# EAGLE design Tiles_Proto3_RevA (EAGLE 8.2.0)
CNAME: TIles Prototype 3; CREVISION: A; DESIGNER: Simone Mora
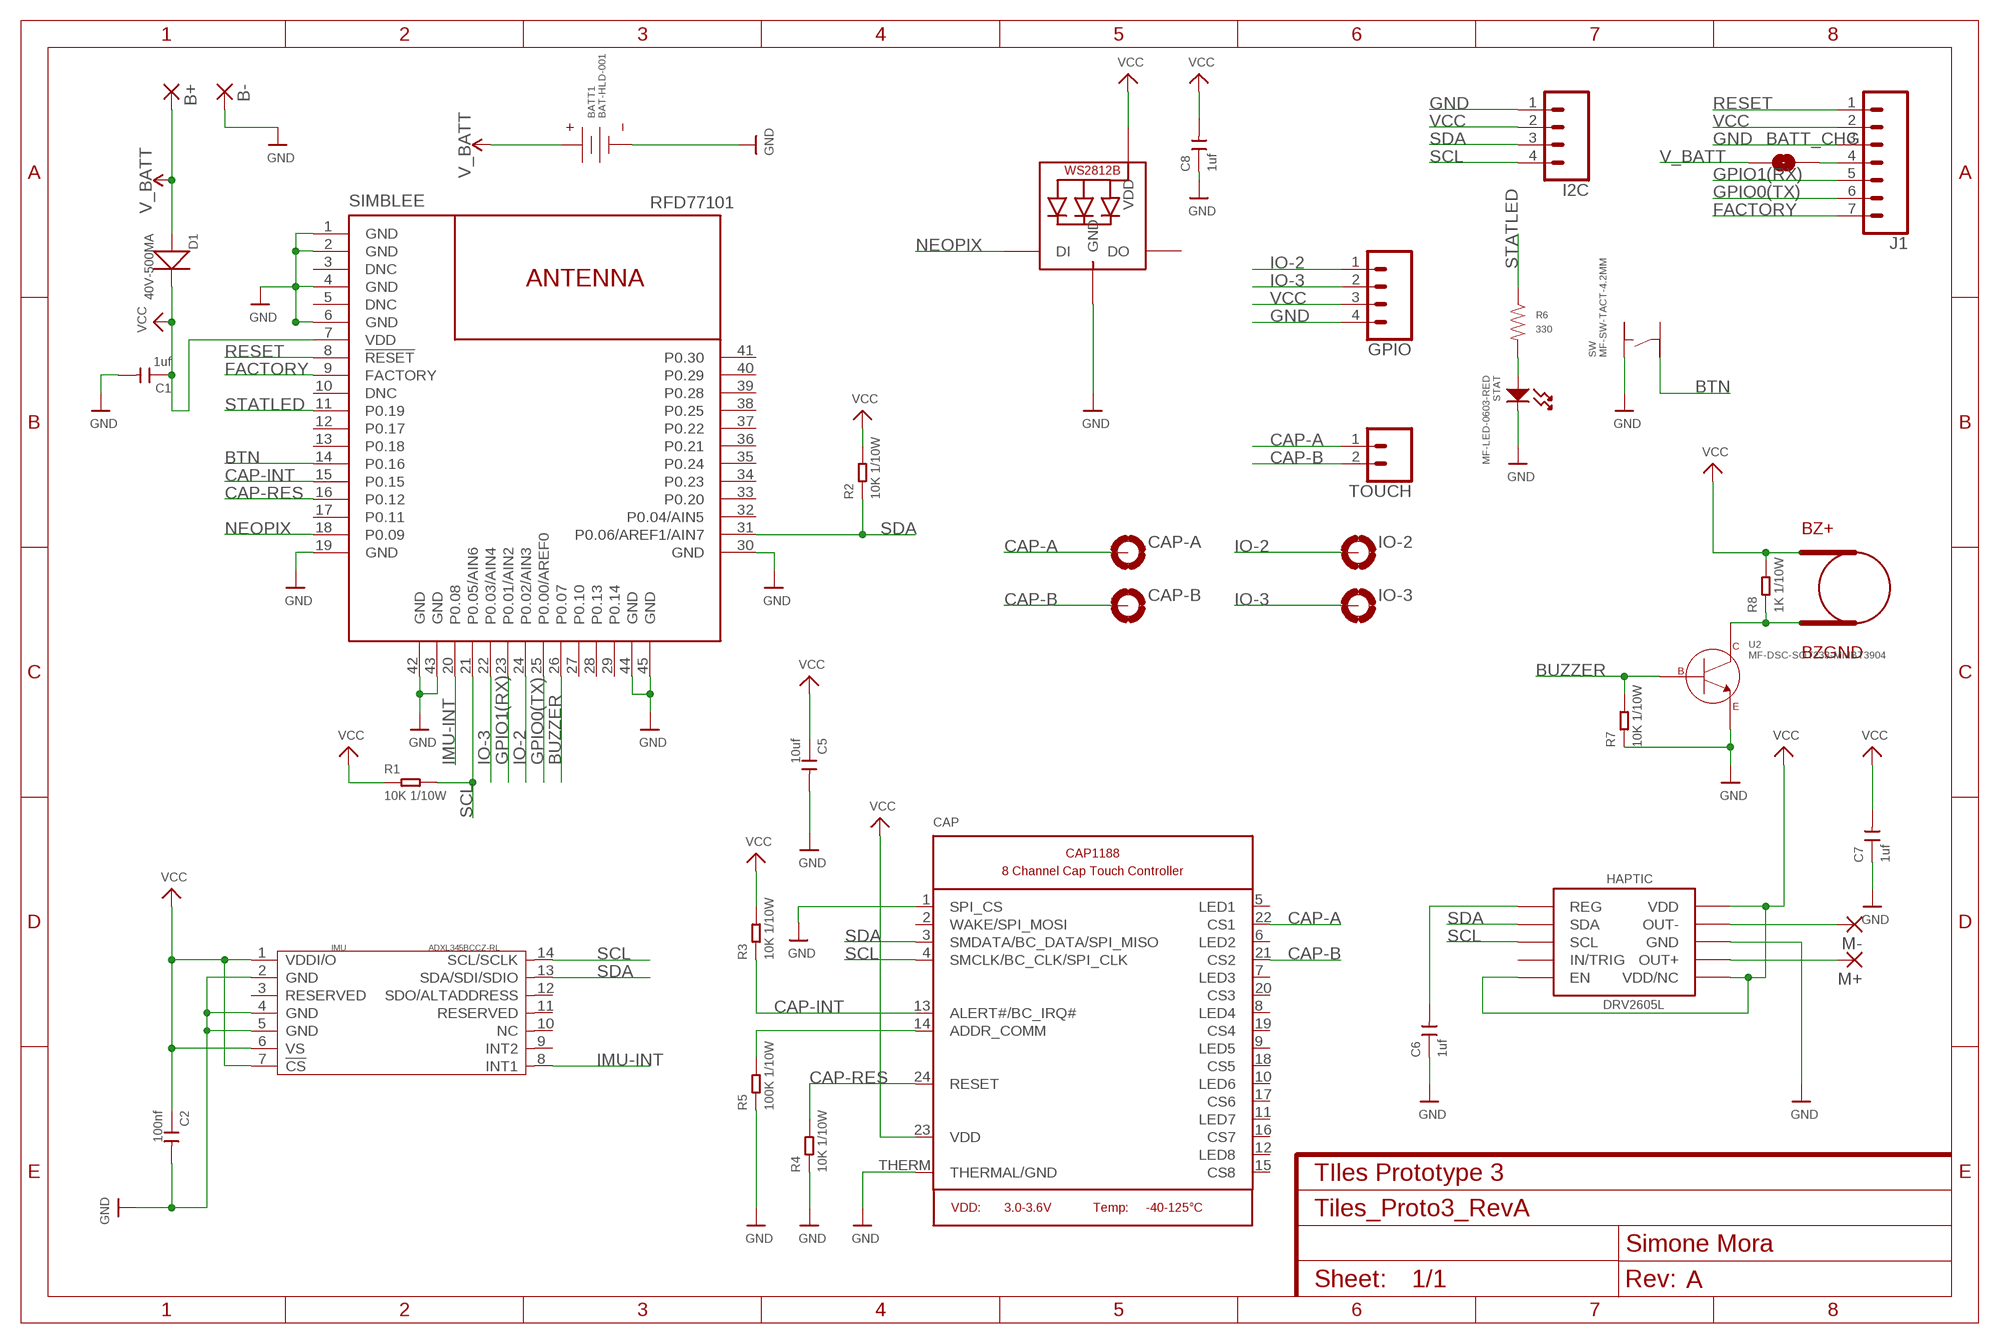
[diagram p0: schematic, sheet 1]

## Parts
B+  1,6/0,8  [1,6/0,8]
B-  1,6/0,8  [1,6/0,8]
BATT1  BAT-HLD-001  BATTERY-SMALL_BAT-HLD-001  [BAT-HLD-001]
BATT_CHG  JUMPER-SMT_2_NO_NO-SILK  [SMT-JUMPER_2_NO_NO-SILK]
BUZZER  4MBUZ  [BUZPKG]
C1  1uf  CERAMIC-10UF-10V-10%-X5R(0603)  [C0603]
C2  100nf  CERAMIC-100NF-50V-10%-X7R(0603)  [C0603]
C5  10uf  CERAMIC-10UF-10V-10%-X5R(0603)  [C0603]
C6  1uf  CERAMIC-1UF-25V-10%-X7R(0603)  [C0603]
C7  1uf  CERAMIC-1UF-25V-10%-X7R(0603)  [C0603]
C8  1uf  CERAMIC-1UF-25V-10%-X7R(0603)  [C0603]
CAP  CAP1188  [QFN24_4MM_SMSC]
CAP-A  MOUNT-PAD-ROUND2.5  [2,5-PAD-SIM]
CAP-B  MOUNT-PAD-ROUND2.5  [2,5-PAD-SIM]
D1  40V-500MA  SMD-DIODE-SCHOTTKY-40V-500MA(SOD-123)  [SOD-123]
GPIO  CONN_041X04_NO_SILK  [1X04_NO_SILK]
HAPTIC  DRV2605L  [VSSOP-10]
I2C  CONN_04_SIM1X04_NO_SILK  [1X04_NO_SILK_LNG]
IMU  ADXL345BCCZ-RL  MOTION/POSITION-ADXL345BCCZ-RL(14P-5.0X3.0MM)  [LGA14-0.8-5.0X3.0MM]
IO-2  MOUNT-PAD-ROUND2.5  [2,5-PAD-SIM]
IO-3  MOUNT-PAD-ROUND2.5  [2,5-PAD-SIM]
J1  CONN_07_SIMSQPAD_BOTTOM  [1X07_SQUAREPADS_BOTTOM]
LED  WS2812B3535  [LED3535]
M+  1,6/0,8  [1,6/0,8]
M-  1,6/0,8  [1,6/0,8]
R1  10K 1/10W  SMD-RES-10K-5%-1/10W(0603)  [R0603]
R2  10K 1/10W  SMD-RES-10K-5%-1/10W(0603)  [R0603]
R3  10K 1/10W  SMD-RES-10K-5%-1/10W(0603)  [R0603]
R4  10K 1/10W  SMD-RES-10K-5%-1/10W(0603)  [R0603]
R5  100K 1/10W  SMD-RES-100K-5%-1/10W(0603)  [R0603]
R6  330  RESISTOR_0603  [R0603]
R7  10K 1/10W  SMD-RES-10K-5%-1/10W(0603)  [R0603]
R8  1K 1/10W  SMD-RES-10K-5%-1/10W(0603)  [R0603]
SIMBLEE  RFD77101  [RFD77101]
STAT  MF-LED-0603-RED  LED_SINGLE-0603-RED  [LED0603]
SW  MF-SW-TACT-4.2MM  TACT_4.2MM  [TACT4.2MM]
TOUCH  CONN_021X02_NO_SILK  [1X02_NO_SILK]
U2  MF-DSC-SOT233-MMBT3904  NPN_BJTMMBT3904_SOT-23-3  [SOT-23-3]

## Nets
BTN: SIMBLEE.14(P0.16) SW.P$3
BUZZER: R7.2 SIMBLEE.26(P0.07) U2.P$1(BASE)
CAP-A: CAP-A.B2,8(MOUNT) CAP.22(CS1) TOUCH.1
CAP-B: CAP-B.B2,8(MOUNT) CAP.21(CS2) TOUCH.2
CAP-INT: CAP.13(ALERT#/BC_IRQ#) R3.1 SIMBLEE.15(P0.15)
CAP-RES: CAP.24(RESET) R4.2 SIMBLEE.16(P0.12)
FACTORY: J1.7 SIMBLEE.9(FACTORY)
GND: B-.1(P) BATT1.NEG_0(NEG) C1.2 C2.2 C5.2 C6.1 C7.1 C8.1 CAP.1(SPI_CS) CAP.THERM(THERMAL/GND) GPIO.4 HAPTIC.P$8(GND) I2C.1 IMU.2(GND) IMU.4(GND) IMU.5(GND) J1.3 LED.4(GND) R4.1 R5.1 R7.1 SIMBLEE.1(GND) SIMBLEE.2(GND) SIMBLEE.4(GND) SIMBLEE.6(GND) SIMBLEE.19(GND) SIMBLEE.30(GND) SIMBLEE.42(GND) SIMBLEE.43(GND) SIMBLEE.44(GND) SIMBLEE.45(GND) STAT.CATHODE SW.P$1 U2.P$2(EMITTER)
GPIO0(TX): J1.6 SIMBLEE.25(P0.00/AREF0)
GPIO1(RX): J1.5 SIMBLEE.23(P0.01/AIN2)
IMU-INT: IMU.8(INT1) SIMBLEE.20(P0.08)
IO-2: GPIO.1 IO-2.B2,8(MOUNT) SIMBLEE.24(P0.02/AIN3)
IO-3: GPIO.2 IO-3.B2,8(MOUNT) SIMBLEE.22(P0.03/AIN4)
N$3: CAP.14(ADDR_COMM) R5.2
N$4: BUZZER.BZ-(BUZGND) R8.1 U2.P$3(COLLECTOR)
N$5: C6.2 HAPTIC.P$1(REG)
N$6: BATT_CHG.2 J1.4
N$7: HAPTIC.P$9(OUT-) M-.1(P)
N$8: HAPTIC.P$7(OUT+) M+.1(P)
N$9: R6.P$2 STAT.ANODE
NEOPIX: LED.1(DI) SIMBLEE.18(P0.09)
RESET: J1.1 SIMBLEE.8(!RESET!)
SCL: CAP.4(SMCLK/BC_CLK/SPI_CLK) HAPTIC.P$2(SCL) I2C.4 IMU.14(SCL/SCLK) R1.2 SIMBLEE.21(P0.05/AIN6)
SDA: CAP.3(SMDATA/BC_DATA/SPI_MISO) HAPTIC.P$3(SDA) I2C.3 IMU.13(SDA/SDI/SDIO) R2.1 SIMBLEE.31(P0.06/AREF1/AIN7)
STATLED: R6.P$1 SIMBLEE.11(P0.19)
V_BATT: B+.1(P) BATT1.POS_0(POS) BATT1.POS_1(POS) BATT_CHG.1 D1.+
VCC: BUZZER.BZ+(BUZSIG+) C1.1 C2.1 C5.1 C7.2 C8.2 CAP.23(VDD) D1.- GPIO.3 HAPTIC.P$5(EN) HAPTIC.P$6(VDD/NC) HAPTIC.P$10(VDD) I2C.2 IMU.1(VDDI/O) IMU.6(VS) IMU.7(!CS) J1.2 LED.2(VDD) R1.1 R2.2 R3.2 R8.2 SIMBLEE.7(VDD)
Unconnected: CAP.2(WAKE/SPI_MOSI) CAP.5(LED1) CAP.6(LED2) CAP.7(LED3) CAP.8(LED4) CAP.9(LED5) CAP.10(LED6) CAP.11(LED7) CAP.12(LED8) CAP.15(CS8) CAP.16(CS7) CAP.17(CS6) CAP.18(CS5) CAP.19(CS4) CAP.20(CS3) HAPTIC.P$4(IN/TRIG) IMU.3(RESERVED) IMU.9(INT2) IMU.10(NC) IMU.11(RESERVED) IMU.12(SDO/ALTADDRESS) LED.3(DO) SIMBLEE.3(DNC) SIMBLEE.5(DNC) SIMBLEE.10(DNC) SIMBLEE.12(P0.17) SIMBLEE.13(P0.18) SIMBLEE.17(P0.11) SIMBLEE.27(P0.10) SIMBLEE.28(P0.13) SIMBLEE.29(P0.14) SIMBLEE.32(P0.04/AIN5) SIMBLEE.33(P0.20) SIMBLEE.34(P0.23) SIMBLEE.35(P0.24) SIMBLEE.36(P0.21) SIMBLEE.37(P0.22) SIMBLEE.38(P0.25) SIMBLEE.39(P0.28) SIMBLEE.40(P0.29) SIMBLEE.41(P0.30) SW.P$2 SW.P$4

## Library data of the parts
B+ B- M+ M- = wirepad:1,6/0,8: THROUGH-HOLE PAD
BATT1 = tiles:BATTERY-SMALL: Library: MF_Connectors Description: Batterys and Battery Connectors.; HOUSEPART: NO; MPN: BAT-HLD-001; POPULATE: 1; URL: http://www.mouser.com/ds/2/238/bat-hld-001-220194.pdf
BATT_CHG = SparkFun-Jumpers:JUMPER-SMT_2_NO: Normally open jumper This jumper has two pads in close proximity to each other. Apply solder to close the connection. Round pads are easier to solder for beginners, but are a lot larger. SparkFun Product that uses the round pads: SparkFun EL Sequencer <https://www.sparkfun.com/products/12781>
BUZZER = tiles:4MBUZ
C1 = Seeed-OPL-Capacitor:CERAMIC-10UF-10V-10%-X5R(0603): 302010103; MPN: CC0603KRX5R6BB106; VALUE: 10uf
C2 = Seeed-OPL-Capacitor:CERAMIC-100NF-50V-10%-X7R(0603): 302010138; MPN: CC0603KRX7R9BB104
C5 = Seeed-OPL-Capacitor:CERAMIC-10UF-10V-10%-X5R(0603): 302010103; MPN: CC0603KRX5R6BB106
C6-C8 = Seeed-OPL-Capacitor:CERAMIC-1UF-25V-10%-X7R(0603): 302010139; MPN: CC0603KRX7R8BB105
CAP = cap1188-microbuilder:CAP1188: CAP1188 - Eight Channel Cap Touch Controller
CAP-A CAP-B IO-2 IO-3 = tiles:MOUNT-PAD-ROUND: MOUNTING PAD, round
D1 = Seeed-OPL-2017-01-Diode-james:SMD-DIODE-SCHOTTKY-40V-500MA(SOD-123): 304020012; MPN: B0540W
GPIO = SparkFun-Connectors:CONN_04: Multi connection point. Often used as Generic Header-pin footprint for 0.1 inch spaced/style header connections On any of the 0.1 inch spaced packages, you can populate with these: Break Away Headers - Straight <https://www.sparkfun.com/products/116> (PRT-00116) Break Away Male Headers - Right Angle <https://www.sparkfun.com/products/553> (PRT-00553) Female Headers <https://www.sparkfun.com/products/115> (PRT-00115) Break Away Headers - Machine Pin <https://www.sparkfun.com/products/117> (PRT-00117) Break Away Female Headers - Swiss Machine Pin <https://www.sparkfun.com/products/743> (PRT-00743) For SCREWTERMINALS and SPRING TERMINALS visit here: Screw Terimnals on SparkFun.com <https://www.sparkfun.com/search/results?term=Screw+Terminals> (5mm/3.5mm/2.54mm spacing) This device is also useful as a general connection point to wire up your design to another part of your project. Our various solder wires solder well into these plated through hole pads. Hook-Up Wire - Assortment (Stranded, 22 AWG) <https://www.sparkfun.com/products/11375> (PRT-11375) Hook-Up Wire - Assortment (Solid Core, 22 AWG) <https://www.sparkfun.com/products/11367> (PRT-11367) View the entire wire category on our website here <https://www.sparkfun.com/categories/141> Special notes: Molex polarized connector foot print use with SKU : PRT-08231 with associated crimp pins and housings. 1MM SMD Version SKU: PRT-10208; PROD_ID: CONN-09696
HAPTIC = SparkFun-IC-Special-Function:DRV2605L; PROD_ID: IC-13504
I2C = tiles:CONN_04_SIM: Multi connection point. Often used as Generic Header-pin footprint for 0.1 inch spaced/style header connections On any of the 0.1 inch spaced packages, you can populate with these: Break Away Headers - Straight <https://www.sparkfun.com/products/116> (PRT-00116) Break Away Male Headers - Right Angle <https://www.sparkfun.com/products/553> (PRT-00553) Female Headers <https://www.sparkfun.com/products/115> (PRT-00115) Break Away Headers - Machine Pin <https://www.sparkfun.com/products/117> (PRT-00117) Break Away Female Headers - Swiss Machine Pin <https://www.sparkfun.com/products/743> (PRT-00743) For SCREWTERMINALS and SPRING TERMINALS visit here: Screw Terimnals on SparkFun.com <https://www.sparkfun.com/search/results?term=Screw+Terminals> (5mm/3.5mm/2.54mm spacing) This device is also useful as a general connection point to wire up your design to another part of your project. Our various solder wires solder well into these plated through hole pads. Hook-Up Wire - Assortment (Stranded, 22 AWG) <https://www.sparkfun.com/products/11375> (PRT-11375) Hook-Up Wire - Assortment (Solid Core, 22 AWG) <https://www.sparkfun.com/products/11367> (PRT-11367) View the entire wire category on our website here <https://www.sparkfun.com/categories/141> Special notes: Molex polarized connector foot print use with SKU : PRT-08231 with associated crimp pins and housings. 1MM SMD Version SKU: PRT-10208; PROD_ID: CONN-09696
IMU = Seeed-OPL-sensor:MOTION/POSITION-ADXL345BCCZ-RL(14P-5.0X3.0MM): 314080008; MPN: ADXL345BCCZ-RL
J1 = tiles:CONN_07_SIM: Multi connection point. Often used as Generic Header-pin footprint for 0.1 inch spaced/style header connections On any of the 0.1 inch spaced packages, you can populate with these: Break Away Headers - Straight <https://www.sparkfun.com/products/116> (PRT-00116) Break Away Male Headers - Right Angle <https://www.sparkfun.com/products/553> (PRT-00553) Female Headers <https://www.sparkfun.com/products/115> (PRT-00115) Break Away Headers - Machine Pin <https://www.sparkfun.com/products/117> (PRT-00117) Break Away Female Headers - Swiss Machine Pin <https://www.sparkfun.com/products/743> (PRT-00743) For SCREWTERMINALS and SPRING TERMINALS visit here: Screw Terimnals on SparkFun.com <https://www.sparkfun.com/search/results?term=Screw+Terminals> (5mm/3.5mm/2.54mm spacing) This device is also useful as a general connection point to wire up your design to another part of your project. Our various solder wires solder well into these plated through hole pads. Hook-Up Wire - Assortment (Stranded, 22 AWG) <https://www.sparkfun.com/products/11375> (PRT-11375) Hook-Up Wire - Assortment (Solid Core, 22 AWG) <https://www.sparkfun.com/products/11367> (PRT-11367) View the entire wire category on our website here <https://www.sparkfun.com/categories/141> Special notes: Molex polarized connector foot print use with SKU : PRT-08231 with associated crimp pins and housings. 1MM SMD Version SKU: PRT-10208 NOTES ON THE VARIANTS LOCK and LOCK_LONGPADS... This footprint was designed to help hold the alignment of a through-hole component (i.e. 6-pin header) while soldering it into place. You may notice that each hole has been shifted either up or down by 0.005 of an inch from it's more standard position (which is a perfectly straight line). This slight alteration caused the pins (the squares in the middle) to touch the edges of the holes. Because they are alternating, it causes a "brace" to hold the component in place. 0.005 has proven to be the perfect amount of "off-center" position when using our standard breakaway headers. Although looks a little odd when you look at the bare footprint, once you have a header in there, the alteration is very hard to notice. Also,if you push a header all the way into place, it is covered up entirely on the bottom side.
LED = adafruit:WS2812B
R1-R4 R7 = Seeed-OPL-Resistor:SMD-RES-10K-5%-1/10W(0603): 301010293; MPN: RC0603JR-0710KL
R5 = Seeed-OPL-Resistor:SMD-RES-100K-5%-1/10W(0603): 301010089; MPN: RC0603JR-07100KL
R6 = MF_Passives:RESISTOR: Library: MF_Passives Description: Device for Resistors. Manufacture part number (MPN), Voltage, Tolerance, and Wattage Rating can be added via Attributes. Check https://factory.macrofab.com/parts for the house parts list.; POPULATE: 1
R8 = Seeed-OPL-Resistor:SMD-RES-10K-5%-1/10W(0603): 301010293; VALUE: 10K 1/10W
SIMBLEE = SparkFun-RF:RFD77101: Simblee  BLE Module RFD77101 © 2015 RF Digital Corporation Datasheet <https://cdn.sparkfun.com/datasheets/IoT/Simblee%20RFD77101%20Datasheet%20v1.0.pdf> PATENTS PENDING 04.01.2015 Bluetooth Smart radio transceiver, ARM Cortex M0 microcontroller. 128kB Flash, 24kB RAM, no EEPROM Arduino-compatible. SparkFun Products: Simblee BLE Module - RFD77101 <https://www.sparkfun.com/products/13808> SparkFun Simblee BLE Breakout - RFD77101 <https://www.sparkfun.com/products/13632>; PROD_ID: COMP-13237; SF_ID: WRL-13808
STAT = MF_LEDs:LED_SINGLE: Library: MF_LEDs Description: Device for Single LED Packages. Manufacture part number (MFG#) can be added via Attributes.; HOUSEPART: YES; MPN: MF-LED-0603-RED; POPULATE: 1; URL: https://factory.macrofab.com/part/MF-LED-0603-RED
SW = MF_Switches:TACT: Library: MF_Switches Description: Device for Tact Switches. Manufacture part number (MFG#) can be added via Attributes.; HOUSEPART: YES; MPN: MF-SW-TACT-4.2MM; POPULATE: 1; URL: https://factory.macrofab.com/part/MF-SW-TACT-4.2MM
TOUCH = SparkFun-Connectors:CONN_02: Multi connection point. Often used as Generic Header-pin footprint for 0.1 inch spaced/style header connections On any of the 0.1 inch spaced packages, you can populate with these: Break Away Headers - Straight <https://www.sparkfun.com/products/116> (PRT-00116) Break Away Male Headers - Right Angle <https://www.sparkfun.com/products/553> (PRT-00553) Female Headers <https://www.sparkfun.com/products/115> (PRT-00115) Break Away Headers - Machine Pin <https://www.sparkfun.com/products/117> (PRT-00117) Break Away Female Headers - Swiss Machine Pin <https://www.sparkfun.com/products/743> (PRT-00743) For SCREWTERMINALS and SPRING TERMINALS visit here: Screw Terimnals on SparkFun.com <https://www.sparkfun.com/search/results?term=Screw+Terminals> (5mm/3.5mm/2.54mm spacing) This device is also useful as a general connection point to wire up your design to another part of your project. Our various solder wires solder well into these plated through hole pads. Hook-Up Wire - Assortment (Stranded, 22 AWG) <https://www.sparkfun.com/products/11375> (PRT-11375) Hook-Up Wire - Assortment (Solid Core, 22 AWG) <https://www.sparkfun.com/products/11367> (PRT-11367) View the entire wire category on our website here <https://www.sparkfun.com/categories/141> Special notes: Molex polarized connector foot print use with: PRT-08233 with associated crimp pins and housings. 2.54_SCREWTERM for use with PRT-10571. 3.5mm Screw Terminal footprints for PRT-08084 5mm Screw Terminal footprints for use with PRT-08432
U2 = MF_Discrete_Semiconductor:NPN_BJT: Library: MF_Discrete_Semiconductor Description: Device for Single NPN BJT Transistors. Manufacture part number (MFG#) can be added via Attributes.; HOUSEPART: YES; MPN: MF-DSC-SOT233-MMBT3904; POPULATE: 1; URL: https://factory.macrofab.com/part/MF-DSC-SOT233-MMBT3904

## Board
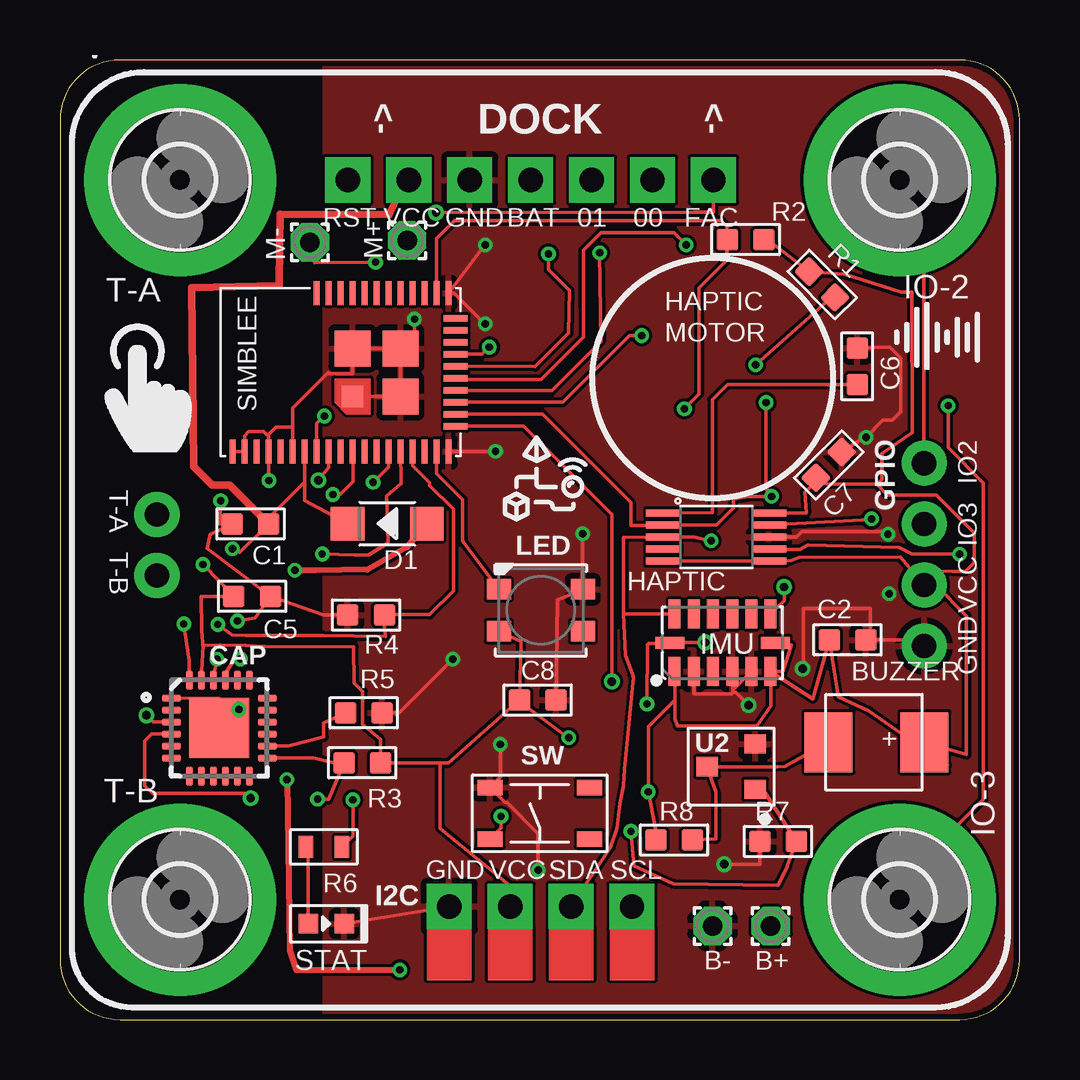
[diagram p1: board, top side]
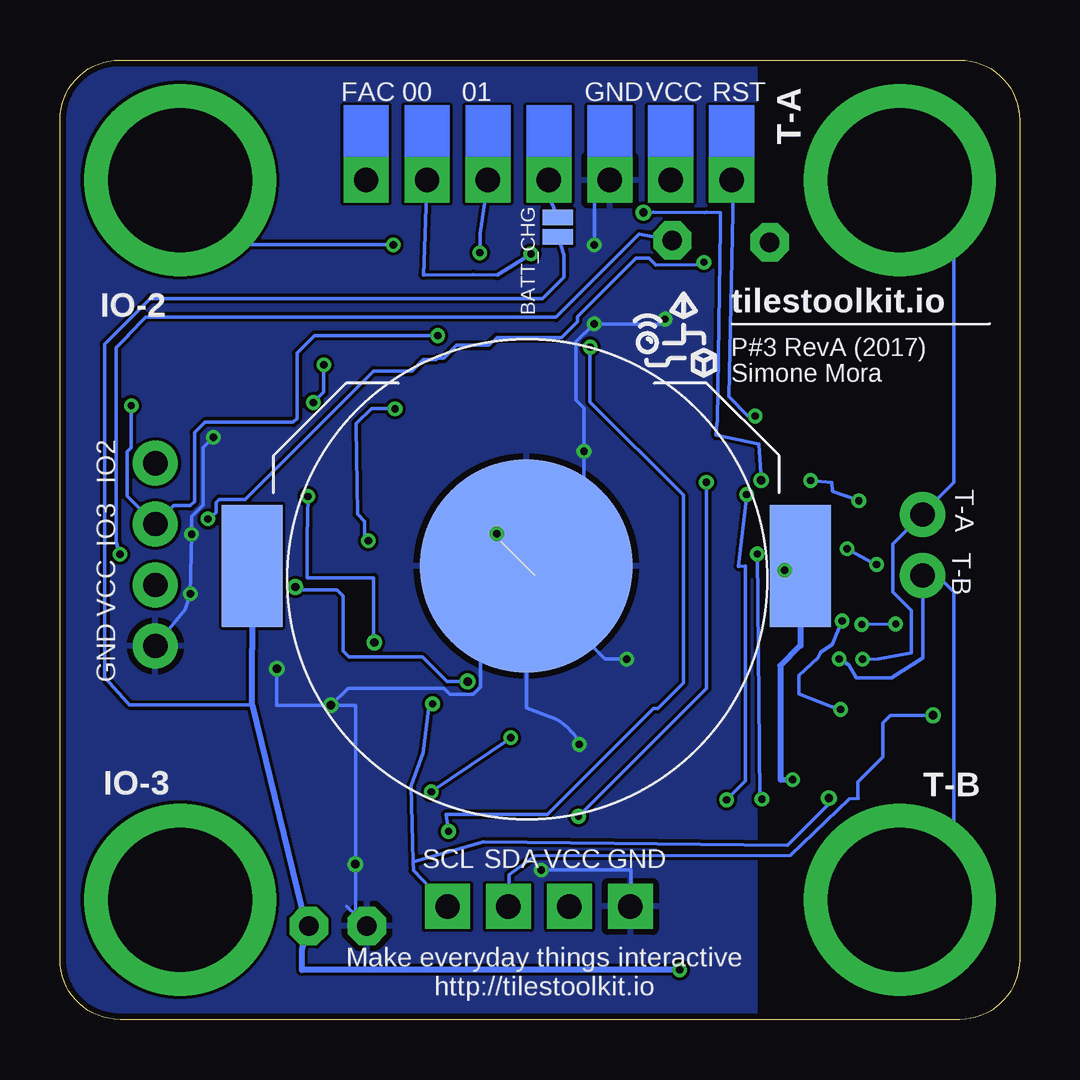
[diagram p2: board, bottom side, seen from below]

Size 40 x 40 mm. Coordinates in mm from the lower left corner, seen from the top.
Outline: 2.5,0 37.5,0 arc90 40,2.5 40,37.5 arc90 37.5,40 2.5,40 arc90 0,37.5 0,2.5 arc90 2.5,0
Copper layers (1*16): Top 0.035mm / dielectric 1.5mm / Bottom 0.035mm
Design rules "MF_4_mil_drill_2_Layer": minimum track width 5mil, minimum drill 4mil, track to track 5mil, track to pad 5mil, pad to pad 5mil, via to via 5mil, smd to smd 0mil, copper to edge 10mil, drill to drill 10mil, minimum pad ring 6mil, minimum via ring 6mil, stop-mask expansion 2mil, vias tented up to drill 25mil, thermal gap 10mil

### Footprints (pad centres in the part's own frame; a part is rotated, then mirrored left to right if it is on the bottom)
1,6/0,8 = drill 0.813 pad 1.6 octagon: 1 0,0
BAT-HLD-001 = smd 8.89 x 8.89: NEG_0 0,0 | smd 2.54 x 5.08: POS_0 11.43,0; POS_1 -11.43,0
SMT-JUMPER_2_NO_NO-SILK = smd 0.635 x 1.27: 1 -0.406,0; 2 0.406,0
BUZPKG = smd 2 x 2.5: BZ+ 1.863,0.222; BZ- -2.137,0.222
C0603 = smd 0.889 x 0.889: 1 0,0.762; 2 0,-0.762
QFN24_4MM_SMSC = smd 0.8 x 0.28: 1 -2,1.25; 2 -2,0.75; 3 -2,0.25; 4 -2,-0.25; 5 -2,-0.75; 6 -2,-1.25; 13 2,-1.25; 14 2,-0.75; 15 2,-0.25; 16 2,0.25; 17 2,0.75; 18 2,1.25 | smd 0.28 x 0.8: 7 -1.25,-2; 8 -0.75,-2; 9 -0.25,-2; 10 0.25,-2; 11 0.75,-2; 12 1.25,-2; 19 1.25,2; 20 0.75,2; 21 0.25,2; 22 -0.25,2; 23 -0.75,2; 24 -1.25,2 | smd 2.5 x 2.5: THERM 0,0
2,5-PAD-SIM = drill 6 pad 8: B2,8 0,0
SOD-123 = smd 1.397 x 1.397: + -1.651,0; - 1.651,0
1X04_NO_SILK = drill 1.016 pad 1.88: 1 0,0; 2 2.54,0; 3 5.08,0; 4 7.62,0
VSSOP-10 = smd 1.45 x 0.3: P$1 -1.905,1.06; P$2 -1.905,0.56; P$3 -1.905,0.06; P$4 -1.905,-0.44; P$5 -1.905,-0.94; P$6 2.495,-0.94; P$7 2.495,-0.44; P$8 2.495,0.06; P$9 2.495,0.56; P$10 2.495,1.06
1X04_NO_SILK_LNG = drill 1.016 pad 1.88 square: 1 0,0; 2 2.54,0; 3 5.08,0; 4 7.62,0
LGA14-0.8-5.0X3.0MM = smd 1.2 x 0.5: 1 -1.2,2; 2 -1.2,1.2; 3 -1.2,0.4; 4 -1.2,-0.4; 5 -1.2,-1.2; 6 -1.2,-2; 8 1.2,-2; 9 1.2,-1.2; 10 1.2,-0.4; 11 1.2,0.4; 12 1.2,1.2; 13 1.2,2 | smd 0.5 x 1.2: 7 0,-2.2; 14 0,2.2
1X07_SQUAREPADS_BOTTOM = drill 1.016 pad 1.88 square: 1 0,0; 2 2.54,0; 3 5.08,0; 4 7.62,0; 5 10.16,0; 6 12.7,0; 7 15.24,0
LED3535 = smd 1 x 0.85: 1 -1.75,0.875; 2 -1.75,-0.875; 3 1.75,-0.875; 4 1.75,0.875
R0603 = smd 0.889 x 0.889: 1 0,0.762; 2 0,-0.762
R0603' = smd 0.6 x 0.9: P$1 -0.75,0; P$2 0.75,0
RFD77101 = smd 1 x 0.254: 1 0,0; 2 0,-0.5; 3 0,-1; 4 0,-1.5; 5 0,-2; 6 0,-2.5; 7 0,-3; 8 0,-3.5; 9 0,-4; 10 0,-4.5; 11 0,-5; 12 0,-5.5; 13 0,-6; 14 0,-6.5; 15 0,-7; 16 0,-7.5; 17 0,-8; 18 0,-8.5; 19 0,-9; 30 6.61,-9; 31 6.61,-8.5; 32 6.61,-8; 33 6.61,-7.5; 34 6.61,-7; 35 6.61,-6.5; 36 6.61,-6; 37 6.61,-5.5; 38 6.61,-5; 39 6.61,-4.5; 40 6.61,-4; 41 6.61,-3.5 | smd 0.254 x 1: 20 1.055,-9.29; 21 1.555,-9.29; 22 2.055,-9.29; 23 2.555,-9.29; 24 3.055,-9.29; 25 3.555,-9.29; 26 4.055,-9.29; 27 4.555,-9.29; 28 5.055,-9.29; 29 5.555,-9.29 | smd 0.9 x 0.9: 42 2.3,-4.99 | smd 1.5 x 1.5: 43 2.3,-6.99; 44 4.3,-6.99; 45 4.3,-4.99
LED0603 = smd 0.8 x 0.8: ANODE 0.75,0; CATHODE -0.75,0
TACT4.2MM = smd 1.05 x 0.65: P$1 -2.075,1.075; P$2 2.075,1.075; P$3 -2.075,-1.075; P$4 2.075,-1.075
1X02_NO_SILK = drill 1.016 pad 1.88: 1 0,0; 2 2.54,0
SOT-23-3 = smd 0.9 x 0.8: P$1 -1,0.95; P$2 -1,-0.95; P$3 1,0

### Placement (x,y rotation side)
B+  29.63,3.89 180 top
B-  27.2,3.9 180 top
BATT1  20.56,18.91 0 bottom
BATT_CHG  19.24,33.03 90 bottom
BUZZER  34.17,11.34 0 top
C1  7.94,20.66 270 top
C2  32.83,15.83 90 top
C5  8.01,17.64 90 top
C6  33.23,27.23 0 top
C7  32.05,23.11 315 top
C8  19.91,13.31 270 top
CAP  6.64,12.15 0 top
CAP-A  5,35 0 top
CAP-B  5,5 0 top
D1  13.64,20.67 180 top
GPIO  36.02,23.2 270 top
HAPTIC  27.06,20.05 0 top
I2C  16.23,4.71 0 top
IMU  27.62,15.71 90 top
IO-2  35,35 0 top
IO-3  35,5 0 top
J1  12,35 0 top
LED  20.05,17.06 0 top
M+  14.47,32.48 90 top
M-  10.41,32.4 90 top
R1  31.77,30.64 45 top
R2  28.58,32.52 90 top
R3  12.6,10.7 90 top
R4  12.76,16.86 90 top
R5  12.66,12.79 270 top
R6  330  [R0603']  11,7.2 180 top
R7  29.93,7.42 90 top
R8  25.6,7.48 270 top
SIMBLEE  7.2,23.68 90 top
STAT  11.1,4 180 top
SW  20,8.6 0 top
TOUCH  4.04,21.05 270 top
U2  27.98,10.54 180 top

### Tracks (layer width: path | path; a pad name or v marks a point on that pad's centre or on a via)
BTN  (via drill 0.3)
  Top 0.152: SIMBLEE.14 13.7,23.04 v13.05,22.39 | v18.38,8.47 18.38,7.98 SW.P$3
  Bottom 0.152: v13.05,22.39 13.05,13.8 v18.38,8.47
BUZZER  (via drill 0.3)
  Top 0.152: U2.P$1 29.29,9.59 R7.2 30.33,6.42 30.3,6.33 29.93,5.6 25.58,5.66 23.94,6.4 v23.8,7.84 | SIMBLEE.26 17.6,27.73 v17.9,28.03
  Bottom 0.152: v17.9,28.03 17.9,25.74 14.02,21.86 14.02,14.03 15.08,12.97 15.26,12.97 19.68,8.55 23.92,8.55 v23.8,7.84
CAP-A  (via drill 0.3)
  Top 0.152: CAP.22 6.4,14.25 v6.54,15.02
  Bottom 0.152: 4.04,35.96 CAP-A.B2,8 2.74,34.74 2.74,22.39 4.04,21.09 TOUCH.1 5.28,19.81 5.28,17.82 4.52,17.06 4.52,15.28 5.88,15.03 v6.54,15.02
CAP-B  (via drill 0.3)
  Top 0.152: CAP.21 6.85,14.39 7.17,14.86 7.34,15.03 v7.52,15.03
  Bottom 0.152: v7.52,15.03 7.12,14.78 6.8,14.24 5.35,14.23 4.03,15.07 TOUCH.2 3.43,18.51 2.74,17.82 2.74,5.26 CAP-B.B2,8
CAP-INT  (via drill 0.3)
  Top 0.152: CAP.13 9.69,10.9 10.57,10.9 11.74,10.62 R3.1 11.2,9.17 v10.74,9.18 | SIMBLEE.15 14.2,23.19 14.21,22.9 14.23,22.34 13.61,21.83 13.68,19.86 12.87,19.36 12.31,19.36 v10.93,19.41
  Bottom 0.152: v10.93,19.41 10.81,9.26 v10.74,9.18
CAP-RES  (via drill 0.3)
  Top 0.152: CAP.24 5.38,14.97 v5.16,16.49 | SIMBLEE.16 14.7,23.1 15.41,22.39 15.41,22.26 16.4,21.27 16.4,17.87 15.41,16.88 13.58,16.89 R4.2 13.5,16.49 13.57,15.98 10.94,16.02 7.74,16.02 7.18,16.04 v6.58,16.47
  Bottom 0.152: v5.16,16.49 v6.58,16.47
FACTORY  (via drill 0.35)
  Top 0.152: SIMBLEE.9 11.2,23.01 v10.77,22.47 | v15.68,33.64 26.44,33.65 27.24,33.65 J1.7
  Bottom 0.152: v10.77,22.47 10.87,24 12.65,24.36 12.61,24.84 12.6,24.95 12.47,33.03 12.47,33.64 13.06,33.65 13.14,33.63 15.25,33.65 v15.68,33.64
GND  (via drill 0.3, 0.35)
  Top 0.152: STAT.CATHODE 16.18,4.69 I2C.1 | v17.72,28.99 16.43,30.29 SIMBLEE.30 v17.72,32.3 | v18.16,23.68 SIMBLEE.19 | v21.79,20.26 21.79,18.54 LED.4 20.75,17.5 C8.1 | v18.36,11.47 18.36,10.11 SW.P$1 18.55,9.05 18.62,9.05 19.93,7.74 v19.93,6.24 | 35.74,15.29 GPIO.4 36.02,15.83 33.78,15.83 | SIMBLEE.1 SIMBLEE.2 7.7,24.33 7.87,24.51 8.49,24.51 8.7,24.3 SIMBLEE.4 | SIMBLEE.44 SIMBLEE.43 SIMBLEE.42 | SIMBLEE.44 SIMBLEE.45 12.19,26.93 11.4,26.93 11.21,26.93 11.17,26.96 9.7,25.48 9.7,24.66 | 28.95,20.11 HAPTIC.P$8 30.7,20.11 30.93,20.34 34.4,20.34 v34.51,20.23 | C7.1 33.51,24.27 v33.6,24.27 34.31,24.98 34.69,24.98 35.05,25.34 35.05,27.57 34.6,28.02 C6.1 | CAP.1 6.64,13.39 CAP.THERM 6.8,12.78 v7.46,12.93 | C5.2 11,16.86 R4.1 | R5.1 14.14,12.79 v16.38,15.02 | C5.2 8.88,17.55 8.84,17.6 7.33,18.74 6.13,19.65 6.26,20.21 C1.2 6.65,20.66 v6.7,21.63 | v7.4,16.61 8.13,16.73 C5.2 | v8.71,22.47 8.71,23.67 SIMBLEE.4 | 9.7,24.66 SIMBLEE.6 | v14.78,29.2 14.78,28.56 SIMBLEE.44 | SIMBLEE.4 8.7,24.38 9.02,24.7 9.66,24.7 9.7,24.66 | IMU.2 26.42,13.58 26.43,13.57 27.99,13.57 28.06,13.64 | 28.06,13.64 28.06,14.47 IMU.4 | 28.06,13.64 28.06,13.74 IMU.5 | 28.06,13.64 28.17,13.64 v28.71,13.1 | v27.69,6.47 29.17,6.47 R7.1 | 33.78,15.83 C2.2 | v30.96,14.63 30.99,14.63 30.99,17.14 33.78,17.14 33.78,15.83
  Bottom 0.152: BATT1.NEG_0 18.16,21.32 v18.16,23.68 18.16,25.49 18.48,25.82 18.48,28.27 18.14,28.61 18.11,28.61 v17.72,28.99 14.98,28.99 v14.78,29.2 | BATT1.NEG_0 20.56,19.03 v21.79,20.26 | 20.56,18.3 BATT1.NEG_0 | 20.56,18.3 20.56,12.98 19.27,12.51 19.15,12.43 18.87,12.2 18.41,11.7 v18.36,11.47 | GPIO.4 34.77,17.09 v34.56,17.75 v34.51,20.23 34.51,20.97 34.03,21.45 34.03,23.84 v33.6,24.27 | v19.93,6.24 19.38,6.24 17.73,6.24 16.21,6.25 I2C.1 | 28.05,4.73 B-.1 27.69,3.9 v27.69,6.47 27.69,13.1 v28.71,13.1 | v7.46,12.93 7.48,12.92 9.19,13.58 9.19,14.34 8.4,15.07 8.28,15.33 7.8,15.63 v7.4,16.61 | v16.38,15.02 17.28,15.02 20.56,18.3 | v6.7,21.63 7.79,22.02 7.81,22.03 7.83,22.39 v8.71,22.47 | v8.71,22.47 8.71,22.44 v8.71,22.47 | v17.72,32.3 17.72,34.58 J1.3 | BATT1.NEG_0 22.48,16.99 22.48,13.87 22.79,13.56 23.74,13.56 23.99,13.81 28,13.81 v28.71,13.1 | v28.71,13.1 30.96,13.1 v30.96,14.63
  pour Top: 11,40 40,40 40,0 11,0
  pour Bottom: 11,40 40,40 40,0 11,0
GPIO0(TX)  (via drill 0.3)
  Top 0.152: v20.37,31.91 20.37,31.26 21.23,30.39 21.2,28.61 19.81,27.22 16.5,27.24 SIMBLEE.25
  Bottom 0.152: v20.37,31.91 21.79,31.03 22.78,31.05 24.85,31.04 J1.6
GPIO1(RX)  (via drill 0.3)
  Top 0.152: v22.5,31.97 22.55,28.26 20.52,26.23 SIMBLEE.23
  Bottom 0.152: J1.5 22.48,32.74 v22.5,31.97
IMU-INT  (via drill 0.35)
  Top 0.152: SIMBLEE.20 19.32,24.73 23.01,21.04 v23.01,14.09 23.01,14.06 | v30.19,18.03 30.19,17.47 IMU.8
  Bottom 0.152: v23.01,14.09 23.87,14.09 24.89,15.11 27.94,15.11 28.19,15.36 28.19,17.65 28.45,17.9 30.06,17.9 v30.19,18.03
IO-2  (via drill 0.3)
  Top 0.152: 21.82,29.83 21.82,29.76 | 21.82,29.76 21.82,28.44 20.06,26.68 17.13,26.68 17.13,26.69 16.53,26.69 SIMBLEE.24 | IO-2.B2,8 35,33.77 36,32.77 36,23.22 GPIO.1 | 21.82,29.76 21.82,32.07 22.55,32.8 25.6,32.8 v26.11,32.3
  Bottom 0.152: v26.11,32.3 33.7,32.3 34.04,32.63 34.04,34.04 IO-2.B2,8
IO-3  (via drill 0.3)
  Top 0.152: SIMBLEE.22 20.96,25.73 23.74,28.51 v24.25,28.51 | IO-3.B2,8 36,6.69 38.5,9.18 38.5,22.37 37.03,23.84 v37.03,25.59
  Bottom 0.152: v24.25,28.51 29.38,28.51 30.12,27.77 30.12,25.06 30.27,24.91 33.95,24.91 34.39,24.47 34.39,21.6 34.56,21.43 35.25,21.43 GPIO.2 37.19,21.82 37.19,23.68 37.03,23.84 v37.03,25.59
N$3
  Top 0.152: CAP.14 9.53,11.4 10.99,11.77 10.99,12.36 R5.2
N$4
  Top 0.152: BUZZER.BZ- 30.21,10.54 29.89,10.53 U2.P$3 26.98,10.47 27.34,9.5 27.34,7.52 R8.1
N$5
  Top 0.152: C6.2 27.83,26.48 27.2,25.84 27.2,25.23 27.19,21.13 HAPTIC.P$1
N$6
  Bottom 0.152: J1.4 19.62,34.28 BATT_CHG.2
N$7  (via drill 0.3)
  Top 0.152: HAPTIC.P$9 33.44,20.82 v33.83,20.87 | v13.15,31.57 10.62,31.56 M-.1
  Bottom 0.152: v33.83,20.87 33.49,21.13 33.49,21.55 33.35,21.68 32.28,21.68 26.92,27.04 25.33,27.04 24.87,27.5 24.32,27.5 24.25,27.57 24,27.57 23.46,28.11 22.12,28.11 21.79,28.44 19.1,28.44 18.43,29.1 18.43,29.3 16,31.74 15.44,31.74 15.16,31.46 13.16,31.48 v13.15,31.57
N$8  (via drill 0.3)
  Top 0.152: v37.49,19.4 35.5,19.4 34.99,19.68 31.18,19.78 30.85,19.6 29.77,19.6 HAPTIC.P$7
  Bottom 0.152: M+.1 15.87,32.73 19.32,29.27 36.42,29.27 37.16,28.54 37.16,28.51 37.66,28 37.66,19.95 37.52,19.31 v37.49,19.4
N$9
  Top 0.152: STAT.ANODE 10.35,7.1 R6.P$2
NEOPIX
  Top 0.152: SIMBLEE.18 15.7,22.76 16.78,21.68 16.78,19.96 LED.1
RESET  (via drill 0.3)
  Top 0.152: SIMBLEE.8 10.7,24.84 v11.02,25.16
  Bottom 0.152: v11.02,25.16 11.32,25.16 12.12,25.96 11.92,34.6 J1.1
SCL  (via drill 0.3, 0.35)
  Top 0.152: SIMBLEE.21 20.12,25.23 23.8,21.55 23.8,20.59 24.22,20.59 25.33,20.59 HAPTIC.P$2 27.37,20.61 28.08,21.33 28.08,21.71 28.67,21.81 v29.66,21.81 29.43,22.16 v29.43,25.72 | R1.2 32.37,30.28 v29,27.29 | CAP.4 3.82,11.9 3.54,11.62 3.54,9.75 3.86,9.43 7.75,9.43 v7.95,9.23 | v26.9,15.72 25.44,15.72 IMU.14 25.4,15.68 24.53,15.68 24.49,15.64 v24.47,13.16
  Bottom 0.152: v29.66,21.81 29.69,20.12 29.69,18.42 29.68,18.41 26.92,18.41 26.92,15.74 v26.9,15.72 | v7.95,9.23 7.95,8.98 9.67,7.26 22.35,7.4 25.28,6.58 | 25.28,6.58 25.27,6.21 I2C.4 | v24.47,13.16 24.63,12.93 24.87,11.12 25.36,9.74 25.28,6.58 | v29,27.29 29,26.15 v29.43,25.72
SDA  (via drill 0.3, 0.35)
  Top 0.152: 23.48,16.93 23.48,17.08 23.48,20.1 24.51,20.11 HAPTIC.P$3 26.46,20.11 v27.14,19.95 | 23.48,16.93 23.57,15.18 23.86,14.4 23.9,14.27 23.54,10.43 23.49,9.74 23.35,9.02 23.23,7.96 22.96,7.17 I2C.3 | 27.81,33.06 R2.1 | 27.81,33.06 27.81,31.66 26.64,30.49 26.64,26.07 v26.03,25.46 | SIMBLEE.31 15.7,32.56 16.45,33.31 27.56,33.31 27.81,33.06 | CAP.3 3.88,12.4 v3.6,12.68 | IMU.13 23.5,16.91 23.48,16.93
  Bottom 0.152: I2C.3 21.28,6.03 20.19,6.82 9.55,6.85 7.09,9.19 6.73,9.22 6.73,9.91 5.69,10.95 5.69,12.37 5.38,12.68 v3.6,12.68 | v26.03,25.46 27.01,25.48 27.66,24.84 27.66,24.7 27.6,21.07 27.3,20.77 27.3,20.11 v27.14,19.95
STATLED  (via drill 0.3)
  Top 0.152: v12.21,9.16 12.21,7.66 R6.P$1 | v11.37,21.89 11.69,21.89 12.22,22.42 12.22,23.66 SIMBLEE.11
  Bottom 0.152: v11.37,21.89 11.71,18.89 11.42,18.9 11.42,9.95 v12.21,9.16
V_BATT  (via drill 0.3)
  Top 0.152: 29.66,3.88 B+.1
  Top 0.254: D1.+ 14.47,19.7 12.82,18.75 10.65,18.72 v9.79,18.73 | v9.46,10 9.58,2.89 9.85,2.07 v14.17,2.07
  Bottom 0.152: BATT_CHG.1 19.26,32.72 18.99,31.86 18.99,30.95 19.88,30.06 36.24,30.06 38.15,28.16 38.15,14.26 37.18,13.2 37.1,13.12 32,13.12 | v9.79,18.73 9.11,18.76 9.7,19.34 8.88,19.34 8.81,19.42 8.81,19.23 BATT1.POS_0
  Bottom 0.254: BATT1.POS_1 31.99,16.49 32,15.43 32,13.12 29.74,3.86 B+.1 29.92,2.94 29.92,2.07 v14.17,2.07 | BATT1.POS_0 9.13,15.59 9.98,14.75 9.97,10 v9.46,10
VCC  (via drill 0.3)
  Top 0.152: R2.2 29.66,32.39 R1.1 32.7,31.07 35.07,30.31 35.51,30.31 35.52,30.3 35.53,24.47 34.26,23.58 34.26,22.52 34.06,22.31 | 34.06,22.31 31.98,22.31 C7.2 31.66,22.53 31.05,21.99 31.11,21.11 HAPTIC.P$10 | 34.06,22.31 34.5,21.87 36.53,21.87 38.12,20.29 38.12,19.05 37.75,18.68 37.22,18.68 36.03,18.69 GPIO.3 | GPIO.3 | GPIO.3 35.04,19.28 30.79,19.25 30.48,19.14 HAPTIC.P$6 | 29.76,19.12 HAPTIC.P$6 | 10.21,22.41 8.7,20.91 C1.1 7.49,19.47 v7.18,19.62 | 10.21,22.41 SIMBLEE.7 | 10.21,22.41 10.21,21.63 D1.- | 5.97,15.58 CAP.23 | 5.97,15.58 5.97,15.44 5.91,16.24 5.88,17.63 C5.1 7.32,17.56 v5.96,18.97 | 15.84,10.7 R3.2 13.36,11.67 12.62,12.3 12.62,13.68 12.26,14.03 12.25,15.54 8.51,15.55 7.73,15.59 6.68,15.61 5.97,15.58 | 15.84,10.7 16.2,10.7 C8.2 | C8.2 19.22,15.77 LED.2 | I2C.2 18.74,5.6 15.84,7.96 15.84,10.7 | GPIO.3 | GPIO.3 36.5,18.11 37.79,16.83 37.79,11.05 BUZZER.BZ+ 36.98,10.61 36.04,11.24 33.73,12.86 32.45,13.44 C2.1 31.39,13.37 IMU.6 | R8.2 24.86,7.48 24.82,7.96 v24.52,9.49 24.52,12.22 25.63,13.33 25.63,13.58 | C8.2 19.28,13.16 v21.2,11.75 | HAPTIC.P$5 HAPTIC.P$6 | 25.63,13.58 25.63,14.5 IMU.1 | 25.63,13.58 25.63,12.54 25.74,12.23 29.06,12.23 29.63,13.08 29.63,14.5 IMU.6 | IMU.6 30.13,14.51 30.48,15.62 29.91,15.62 IMU.7
  Top 0.305: J1.2 14.54,35.25 13.71,33.56 9.18,33.57 9.16,32.3 9.14,30.59 5.49,30.51 5.58,23.05 6.34,22.29 7.07,22.29 C1.1
  Bottom 0.152: v21.2,11.75 v24.52,9.49 | v5.96,18.97 6,18.96 v7.18,19.62

### Text on the board
tPlace: /Users/Simone/Downloads/digi.bmp | <- | DOCK | <- | RST | VCC | GND | BAT | 01 | 00 | FAC | T-A | HAPTIC | IO-2 | MOTOR | T-A | IO2 | /Users/Simone/Desktop/noun_143916_cc.bmp | IO3 | T-B | VCC | GND | T-B | IO-3 | GND | VCC | SDA | SCL
bPlace: T-A | RST | VCC | GND | 01 | 00 | FAC | tilestoolkit.io | IO-2 | P#3 RevA (2017) | Simone Mora | /Users/Simone/Desktop/noun_143916_cc.bmp | T-A | IO2 | IO3 | T-B | VCC | GND | T-B | IO-3 | GND | VCC | SDA | SCL | Make everyday things interactive / http://tilestoolkit.io